# Altium project EDP_Project.PrjPcb
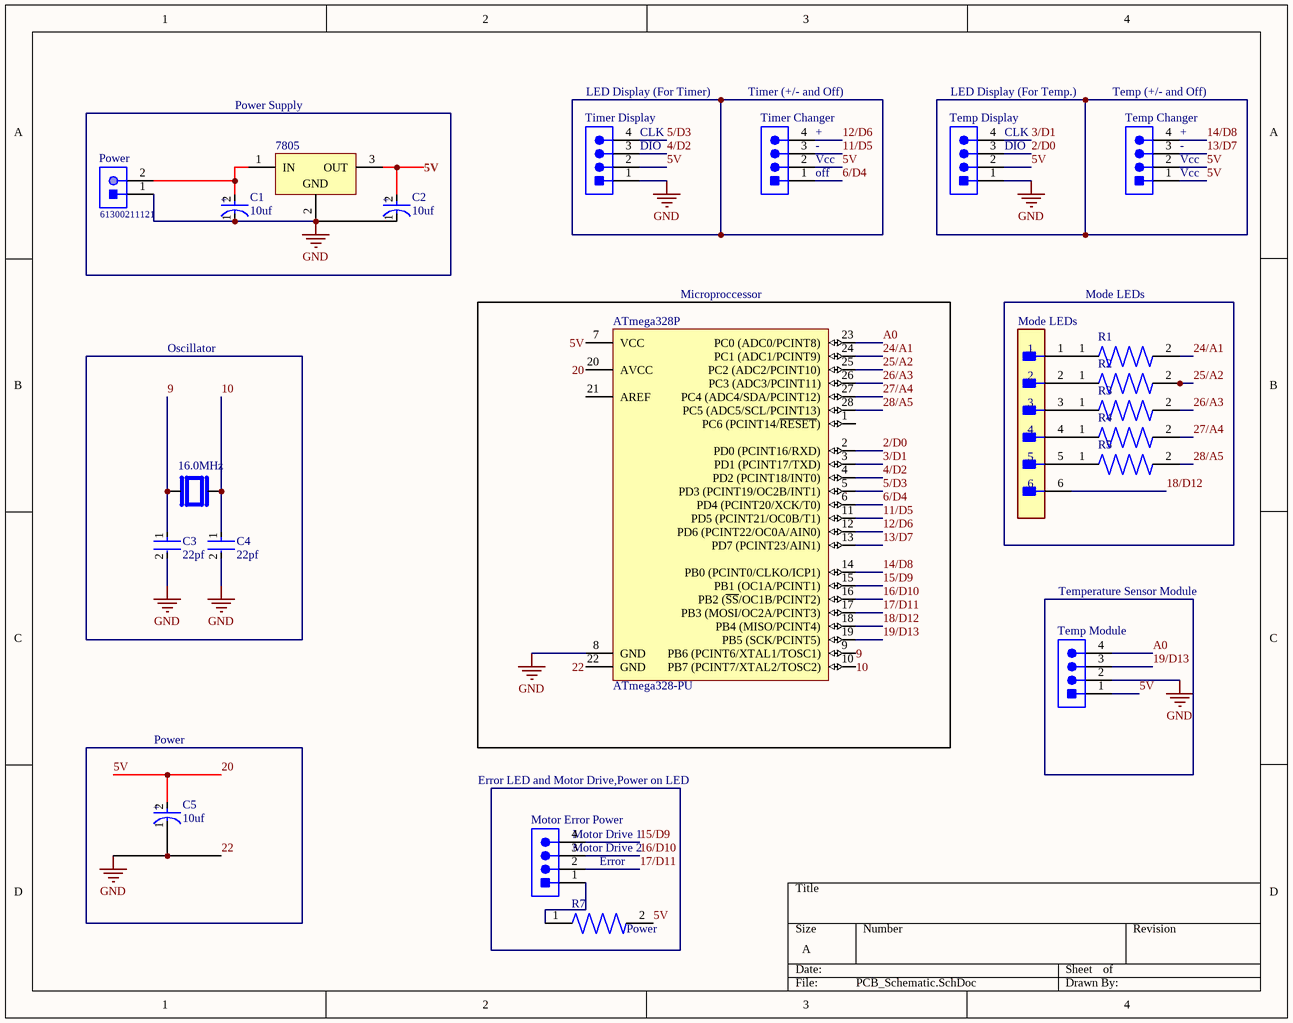
[diagram p0: PCB_Schematic.SchDoc]
1 sheet, 22 parts. Net scope: global (net labels, ports and power ports of the same name join across sheets).
Board file: Project_PCB.PcbDoc

## Sheet PCB_Schematic.SchDoc
size A; SheetNumber: 1; SheetTotal: 1

### Parts
16.0MHz  ABL-16.000MHz-B4Y-T  [XTAL_HC49P488W46L1150T500H350]  (value not drawn)
7805  (no value)  [TO220]
ATmega328P  ATmega328-PU  [28P3]
C1  10uf  [FP-RAD-TH-D_5_0_5-L_11_1-MFG]
C2  10uf  [FP-RAD-TH-D_5_0_5-L_11_1-MFG]
C3  22pf  [FP-RCE0K1-MFG]
C4  22pf  [FP-RCE0K1-MFG]
C5  10uf  [FP-RAD-TH-D_5_0_5-L_11_1-MFG]
Mode_LEDs  22-28-4060  [FP-22-28-4060-MFG]  (value not drawn)
Motor_Error_Power  640456-4  [TECO-640456-4]  (value not drawn)
Power  61300211121  [61300211121]
R1  1623928-4  [RESAD700W45L350D185]  (value not drawn)
R2  1623928-4  [RESAD700W45L350D185]  (value not drawn)
R3  1623928-4  [RESAD700W45L350D185]  (value not drawn)
R4  1623928-4  [RESAD700W45L350D185]  (value not drawn)
R5  1623928-4  [RESAD700W45L350D185]  (value not drawn)
R7  1623928-4  [RESAD700W45L350D185]  (value not drawn)
Temp_Changer  640456-4  [TECO-640456-4]  (value not drawn)
Temp_Display  640456-4  [TECO-640456-4]  (value not drawn)
Temp_Module  640456-4  [TECO-640456-4]  (value not drawn)
Timer_Changer  640456-4  [TECO-640456-4]  (value not drawn)
Timer_Display  640456-4  [TECO-640456-4]  (value not drawn)

### Nets
22: 7805.2(GND) ATmega328P.8(GND) ATmega328P.22(GND) C1.1(C) C2.1(C) C3.2 C4.2 C5.1(C) Power.1 Temp_Display.1 Temp_Module.2 Timer_Display.1  [also labelled GND]
2/D0: ATmega328P.2(PD0_(PCINT16/RXD)) Temp_Display.3
3/D1: ATmega328P.3(PD1_(PCINT17/TXD)) Temp_Display.4
4/D2: ATmega328P.4(PD2_(PCINT18/INT0)) Timer_Display.3
5/D3: ATmega328P.5(PD3_(PCINT19/OC2B/INT1)) Timer_Display.4
6/D4: ATmega328P.6(PD4_(PCINT20/XCK/T0)) Timer_Changer.1
9: 16.0MHz.1 ATmega328P.9(PB6_(PCINT6/XTAL1/TOSC1)) C3.1
10: 16.0MHz.2 ATmega328P.10(PB7_(PCINT7/XTAL2/TOSC2)) C4.1
11/D5: ATmega328P.11(PD5_(PCINT21/OC0B/T1)) Timer_Changer.3
12/D6: ATmega328P.12(PD6_(PCINT22/OC0A/AIN0)) Timer_Changer.4
13/D7: ATmega328P.13(PD7_(PCINT23/AIN1)) Temp_Changer.3
14/D8: ATmega328P.14(PB0_(PCINT0/CLKO/ICP1)) Temp_Changer.4
15/D9: ATmega328P.15(PB1_(OC1A/PCINT1)) Motor_Error_Power.4
16/D10: ATmega328P.16(PB2_(~{SS}/OC1B/PCINT2)) Motor_Error_Power.3
17/D11: ATmega328P.17(PB3_(MOSI/OC2A/PCINT3)) Motor_Error_Power.2
18/D12: ATmega328P.18(PB4_(MISO/PCINT4)) Mode_LEDs.6
19/D13: ATmega328P.19(PB5_(SCK/PCINT5)) Temp_Module.3
20: 7805.3(OUT) ATmega328P.7(VCC) ATmega328P.20(AVCC) C2.2(A) C5.2(A) R7.2 Temp_Changer.1 Temp_Changer.2 Temp_Display.2 Temp_Module.1 Timer_Changer.2 Timer_Display.2  [also labelled 5V]
24/A1: ATmega328P.24(PC1_(ADC1/PCINT9)) R1.2
25/A2: ATmega328P.25(PC2_(ADC2/PCINT10)) R2.2
26/A3: ATmega328P.26(PC3_(ADC3/PCINT11)) R3.2
27/A4: ATmega328P.27(PC4_(ADC4/SDA/PCINT12)) R4.2
28/A5: ATmega328P.28(PC5_(ADC5/SCL/PCINT13)) R5.2
A0: ATmega328P.23(PC0_(ADC0/PCINT8)) Temp_Module.4
Net7805_1: 7805.1(IN) C1.2(A) Power.2
NetMode_LEDs_1: Mode_LEDs.1 R1.1
NetMode_LEDs_2: Mode_LEDs.2 R2.1
NetMode_LEDs_3: Mode_LEDs.3 R3.1
NetMode_LEDs_4: Mode_LEDs.4 R4.1
NetMode_LEDs_5: Mode_LEDs.5 R5.1
NetMotor_Error_Power_1: Motor_Error_Power.1 R7.1

Not connected (* = marked no-connect by the designer): ATmega328P 1(PC6_(PCINT14/~{RESET})) 21(AREF)

### Notes on the sheet
- (near Timer_Display) LED Display (For Timer)
- (near Timer_Changer) Timer (+/- and Off)
- (near Temp_Display) LED Display (For Temp.)
- (near Temp_Changer) Temp (+/- and Off)
- Power Supply
- (near Timer_Display) CLK
- (near Timer_Display) DIO
- (near Timer_Changer) +
- (near Timer_Changer) -
- (near Timer_Changer) Vcc
- (near Temp_Display) CLK
- (near Temp_Display) DIO
- (near Temp_Changer) +
- (near Temp_Changer) -
- (near Temp_Changer) Vcc
- (near Timer_Changer) off
- (near ATmega328P) Microproccessor
- Mode LEDs
- Oscillator
- Temperature Sensor Module
- Power
- Error LED and Motor Drive,Power on LED
- (near Motor_Error_Power) Motor Drive 1
- (near Motor_Error_Power) Motor Drive 2
- Error
- (near R7) Power
- (in symbol CMP-05427-001989-1) +

### Library data of the parts
16.0MHz = ABL-16.000MHz-B4Y-T: 16MHz Â±30ppm Crystal 18pF 40 Ohms HC-49/US; MF: Abracon LLC; Package: HC-49/US ABRACON; Price: None; Purchase-URL: https://pricing.snapeda.com/search/part/ABL-16.000MHz-B4Y/?ref=eda; Check_prices: https://www.snapeda.com/parts/ABL-16.000MHz-B4Y/Abracon+LLC/view-part/?ref=eda; Value: *; SnapEDA_Link: https://www.snapeda.com/parts/ABL-16.000MHz-B4Y/Abracon+LLC/view-part/?ref=snap; Availability: In Stock; MP: ABL-16.000MHz-B4Y
7805 = CMP-0244-00483-1: Positive Voltage Regulator, 5V, 3-Pin TO-220; PackageDescription: TO, Thru-Hole, Vertical, Heatsink Mounted; 3 In-Line Leads; Pitch 2.54 mm; ComponentLink2Description: Datasheet; PackageReference: TO220; ComponentLink3URL: http://www.st.com/internet/com/TECHNICAL_RESOURCES/TECHNICAL_LITERATURE/PACKAGE_INFORMATION/CD00004649.pdf; DatasheetVersion: 16/11/2011; ComponentLink1Description: Manufacturer URL; ComponentLink1URL: http://www.st.com; PackageVersion: ver3.0; ComponentLink3Description: Package Specification; ComponentLink2URL: http://www.st.com/internet/com/TECHNICAL_RESOURCES/TECHNICAL_LITERATURE/DATASHEET/CD00000444.pdf
ATmega328P = CMP-0095-00015-2: 8-bit AVR Microcontroller, 32KB Flash, 1KB EEPROM, 2KB SRAM, 28-pin PDIP, Industrial Grade (-40°C to 85°C); ComponentLink3Description: ATmega48A/48PA/88A/88PA/168A/168PA/328/328P Summary; RevisionNote: DatasheetVersion updated. URLs added.; DatasheetVersion: revD, May-2011; ComponentLink1URL: http://www.atmel.com/; PackageVersion: revB, Sep-2001; PackageDescription: 28-lead (0.300"/7.62mm Wide) Plastic Dual Inline Package (PDIP); PackageReference: 28P3; ComponentLink1Description: Manufacturer URL; ComponentLink2Description: ATmega48A/48PA/88A/88PA/168A/168PA/328/328P Datasheet; ComponentLink3URL: http://www.atmel.com/dyn/resources/prod_documents/8271S.pdf; ComponentLink2URL: http://www.atmel.com/dyn/resources/prod_documents/8271.pdf
C1 C2 C5 = CMP-05427-001989-1: Aluminum Electrolytic Capacitors (Radial Lead Type) AEC-Q200 Qualified 22uF ±20% 50V; Ripple Current: 155mA; Polarity: Polar; ESR (Equivalent Series Resistance): 1.3R; Life (Hours): 1000Hour; Leakage Current: 3uA; Lead Diameter: 0.5mm; Termination: Radial; Radiation Hardening: No; RoHS Compliant: Yes; Case/Package: Radial; Height: 11mm; Package Quantity: 2000; Min Operating Temperature: -55°C; Length: 11mm; Contact Plating: Tin; Series: FC; Voltage Rating: 50V; Diameter: 5mm; Capacitance: 22uF; Features: General Purpose; Max Operating Temperature: 105°C; Tolerance: 20%; Voltage Rating (DC): 50V; Mount: Through Hole; Impedance: 1.3R; Lead Pitch: 0.197inch; Packaging: Tape and Reel; Height - Seated (Max): 0.472inch
C3 C4 = CMP-06035-004895-1: Cap Ceramic 22pF 50V C0G ±5% Radial 5mm +125°C Automotive Bulk; Lead/Base Style: Formed Leads; Lead Diameter: 0.5mm; Max Operating Temperature: 125°C; Termination: Radial; Package Quantity: 2000; Capacitance: 22pF; Dielectric: C0G; Height - Seated (Max): 0.138inch; Width: 0.098inch; Lead Pitch: 0.197inch; Tolerance: 5%; Resistor Type: Ceramic; Case/Package: Radial; Mount: Through Hole; Voltage Rating: 50V; Ratings: AEC-Q200; Min Operating Temperature: -55°C; Packaging: Tape and Reel; Voltage Rating (DC): 50V; Height: 3.5mm; Length: 0.142inch
Mode_LEDs = CMP-04776-000763-1: CONN HEADER VERT 6POS 2.54MM; Voltage Rating: 250V; Current Rating: 4A; Number of Contacts: 6; Max Voltage Rating (DC): 250.25kV; Gender: Male; Contact Resistance: 20mR; Connector Type: Male Pin; Color: Black; Max Voltage Rating (AC): 250V; Pitch: 2.54mm; Orientation: Straight; Max Operating Temperature: 75°C; Contact Plating: Tin; Depth: 2.49mm; Contact Type: Male Pin; Number of Positions: 6; Length: 15.24mm; Packaging: Bulk; Mount: Through Hole; Housing Material: Thermoplastic; Housing Color: Black; Termination: Solder; Contact Material: Brass; Min Operating Temperature: 0°C; Series: KK® 42375; Number of Rows: 1; Package Quantity: 1; RoHS Compliant: Yes; Contact Mating Length: 0.24inch
Motor_Error_Power Temp_Changer Temp_Display Temp_Module Timer_Changer Timer_Display = CMP-2000-05419-1: Male Header, Pitch 2.54 mm, 1 x 4 Position, Height 10.03 mm, Tail Length 3.56 mm, RoHS, Bulk; Manufacturer: TE Connectivity; Material, Housing: Polyester; Primary Type: InterconnectSystem; Mount Angle: Vertical; Color, Housing: White; Current, Rating: 5 / A; Agency Approvals: CSA,UL; Contact Termination Area Plating: Tin; Temperature, Operating: -55to+105 / degC; Standards: RoHSCompliant,ELVCompliant,UL94V-0; Number of Positions: 4; Brand/Series: MTA-100Series; Angle: Straight; Pin Spacing: 0.1 / "; Material, Contact: CopperAlloy; Connector Type: MTA-100; Special Features: Pinstrip; Mounting Hole Size: 0.04 / "; Contact Centerline Spacing: 0.100 / in.; Voltage, Rating: 250 / V; Manufacturer URL: http://www.te.com/; Length, Pin: 0.14 / "; Length, Overall: 0.4 / "; Color: White; Flammability Rating: UL94V-0; Mounting Type: PCMount; Termination: Solder; Datasheet URL: https://datasheet.ciiva.com/16286/eng-ds-82056-mta-0608-16286228.pdf; Number of Contacts: 4; Contact Shape: Square; Contact Mating Area Plating: Tin; Length, Terminal Post: 0.14 / in.; Size, Post: 0.025 / in.; Contact Plating: Tin; Type: PCBPlug; Datasheet Version: Dec-14; Number of Rows: 1
Power = CMP-1712-00002-4: THT Vertical Pin Header WR-PHD, Pitch 2.54 mm, Single Row, 2 pins; Manufacturer: Wurth Elektronik; Rated Current: 3A; Gender: Male; Withstanding Voltage: 500VAC; Working Voltage: 250VAC; Pitch: 2.54mm; Contact Resistance: 20mOhm; Pin Number: 2; Mounting Technology: THT; Orientation: Vertical; Operating Temperature: -40to105degC; Packaging: Bag; Publisher: WurthElektronik; Datasheet URL: https://katalog.we-online.de/em/datasheet/6130xx11121.pdf; Manufacturer URL: http://www.we-online.de; Row Number: Single; Package Reference: 61300211121; Part Number: 61300211121
R1-R5 R7 = 1623928-4: CFR16 5% 10K; Package: None; Price: None; Value: *; MP: 1623928-4; Availability: Unavailable